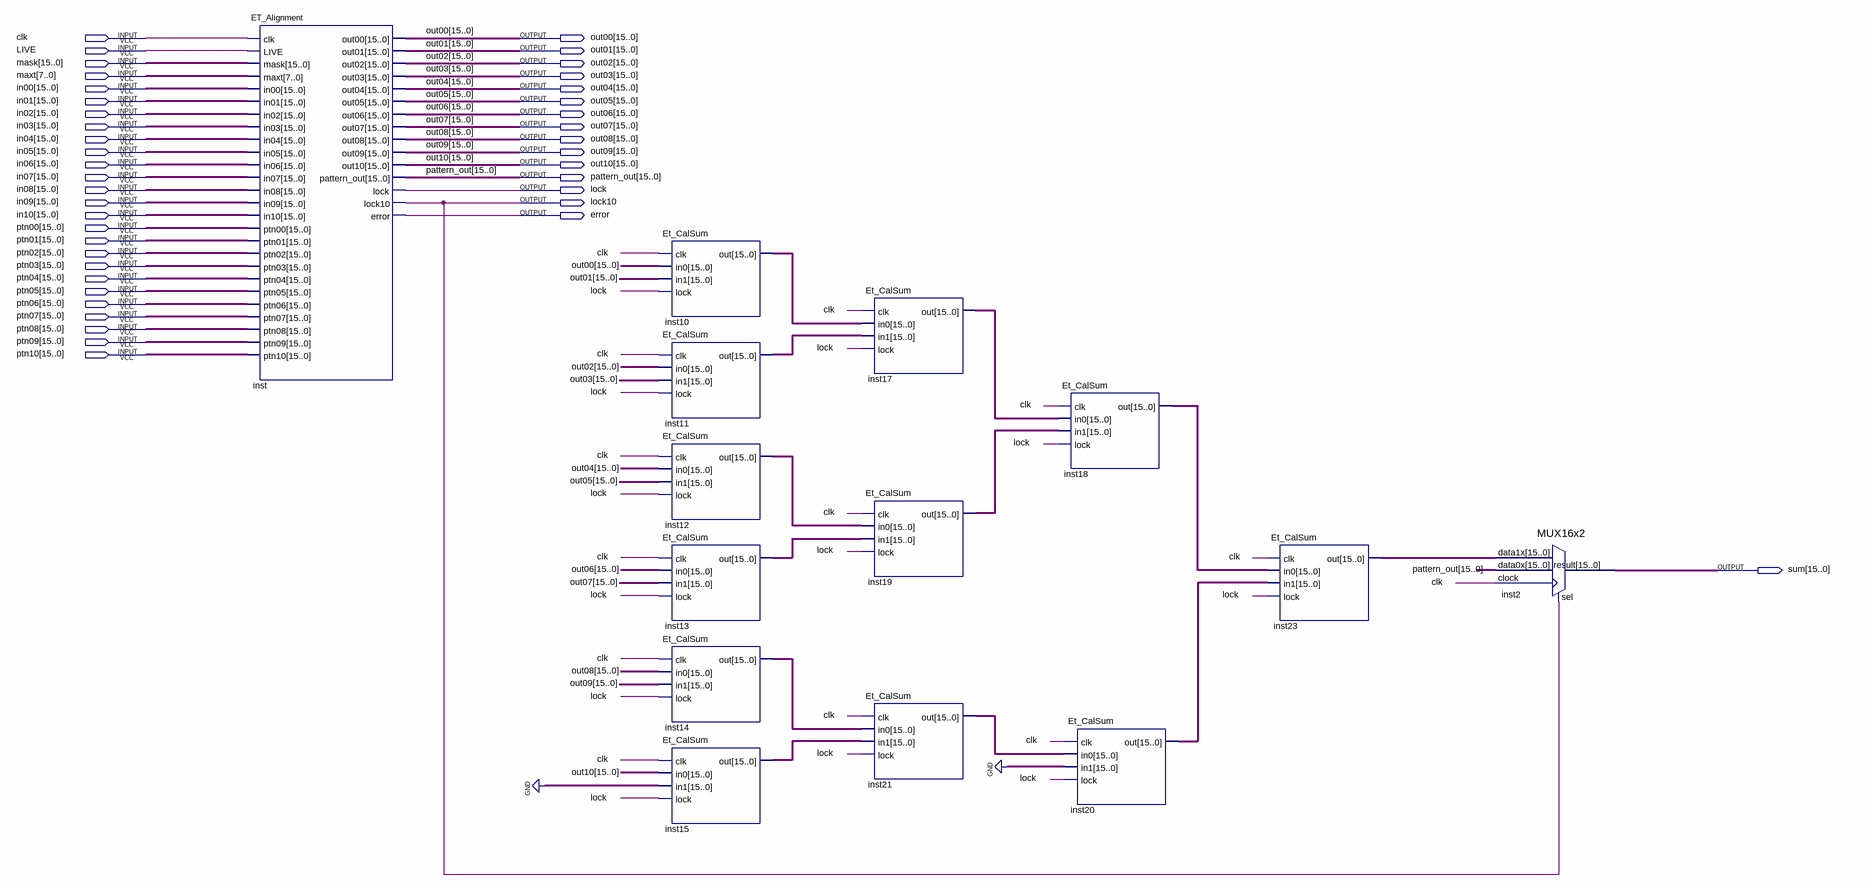
[diagram p0: schematic sheet]
// Quartus schematic OFC_Et_Sum.bdf as structural Verilog: 14 symbols, 42 pins
module OFC_Et_Sum (
  input  clk,
  input  LIVE,
  input  [15:0] mask,
  input  [7:0] maxt,
  input  [15:0] in00,
  input  [15:0] in01,
  input  [15:0] in02,
  input  [15:0] in03,
  input  [15:0] in04,
  input  [15:0] in05,
  input  [15:0] in06,
  input  [15:0] in07,
  input  [15:0] in08,
  input  [15:0] in09,
  input  [15:0] in10,
  input  [15:0] ptn00,
  input  [15:0] ptn01,
  input  [15:0] ptn02,
  input  [15:0] ptn03,
  input  [15:0] ptn04,
  input  [15:0] ptn05,
  input  [15:0] ptn06,
  input  [15:0] ptn07,
  input  [15:0] ptn08,
  input  [15:0] ptn09,
  input  [15:0] ptn10,
  output [15:0] out00,
  output [15:0] out01,
  output [15:0] out02,
  output [15:0] out03,
  output [15:0] out04,
  output [15:0] out05,
  output [15:0] out06,
  output [15:0] out07,
  output [15:0] out08,
  output [15:0] out09,
  output [15:0] out10,
  output [15:0] pattern_out,
  output lock,
  output lock10,
  output error,
  output [15:0] sum
);

  wire [15:0] inst10_out, inst11_out, inst12_out, inst13_out, inst14_out, inst15_out, inst17_out, inst18_out,
       inst19_out, inst20_out, inst21_out, inst23_out;

  ET_Alignment inst (
    .clk(clk), .LIVE(LIVE), .mask(mask), .maxt(maxt), .in00(in00), .in01(in01), .in02(in02), .in03(in03),
    .in04(in04), .in05(in05), .in06(in06), .in07(in07), .in08(in08), .in09(in09), .in10(in10), .ptn00(ptn00),
    .ptn01(ptn01), .ptn02(ptn02), .ptn03(ptn03), .ptn04(ptn04), .ptn05(ptn05), .ptn06(ptn06), .ptn07(ptn07),
    .ptn08(ptn08), .ptn09(ptn09), .ptn10(ptn10), .out00(out00), .out01(out01), .out02(out02), .out03(out03),
    .out04(out04), .out05(out05), .out06(out06), .out07(out07), .out08(out08), .out09(out09), .out10(out10),
    .pattern_out(pattern_out), .lock(lock), .lock10(lock10), .error(error));
  Et_CalSum inst10 (.clk(clk), .in0(out00), .in1(out01), .lock(lock), .out(inst10_out));
  Et_CalSum inst11 (.clk(clk), .in0(out02), .in1(out03), .lock(lock), .out(inst11_out));
  Et_CalSum inst12 (.clk(clk), .in0(out04), .in1(out05), .lock(lock), .out(inst12_out));
  Et_CalSum inst13 (.clk(clk), .in0(out06), .in1(out07), .lock(lock), .out(inst13_out));
  Et_CalSum inst14 (.clk(clk), .in0(out08), .in1(out09), .lock(lock), .out(inst14_out));
  Et_CalSum inst15 (.clk(clk), .in0(out10), .in1({16{1'b0}}), .lock(lock), .out(inst15_out));
  Et_CalSum inst17 (.clk(clk), .in0(inst10_out), .in1(inst11_out), .lock(lock), .out(inst17_out));
  Et_CalSum inst19 (.clk(clk), .in0(inst12_out), .in1(inst13_out), .lock(lock), .out(inst19_out));
  Et_CalSum inst21 (.clk(clk), .in0(inst14_out), .in1(inst15_out), .lock(lock), .out(inst21_out));
  Et_CalSum inst18 (.clk(clk), .in0(inst17_out), .in1(inst19_out), .lock(lock), .out(inst18_out));
  Et_CalSum inst20 (.clk(clk), .in0(inst21_out), .in1({16{1'b0}}), .lock(lock), .out(inst20_out));
  Et_CalSum inst23 (.clk(clk), .in0(inst18_out), .in1(inst20_out), .lock(lock), .out(inst23_out));
  MUX16x2 inst2 (.data1x(inst23_out), .data0x(pattern_out), .clock(clk), .sel(lock10), .result(sum));
endmodule
